# EAGLE design Oscillator 1.0 (EAGLE 7.2.0)
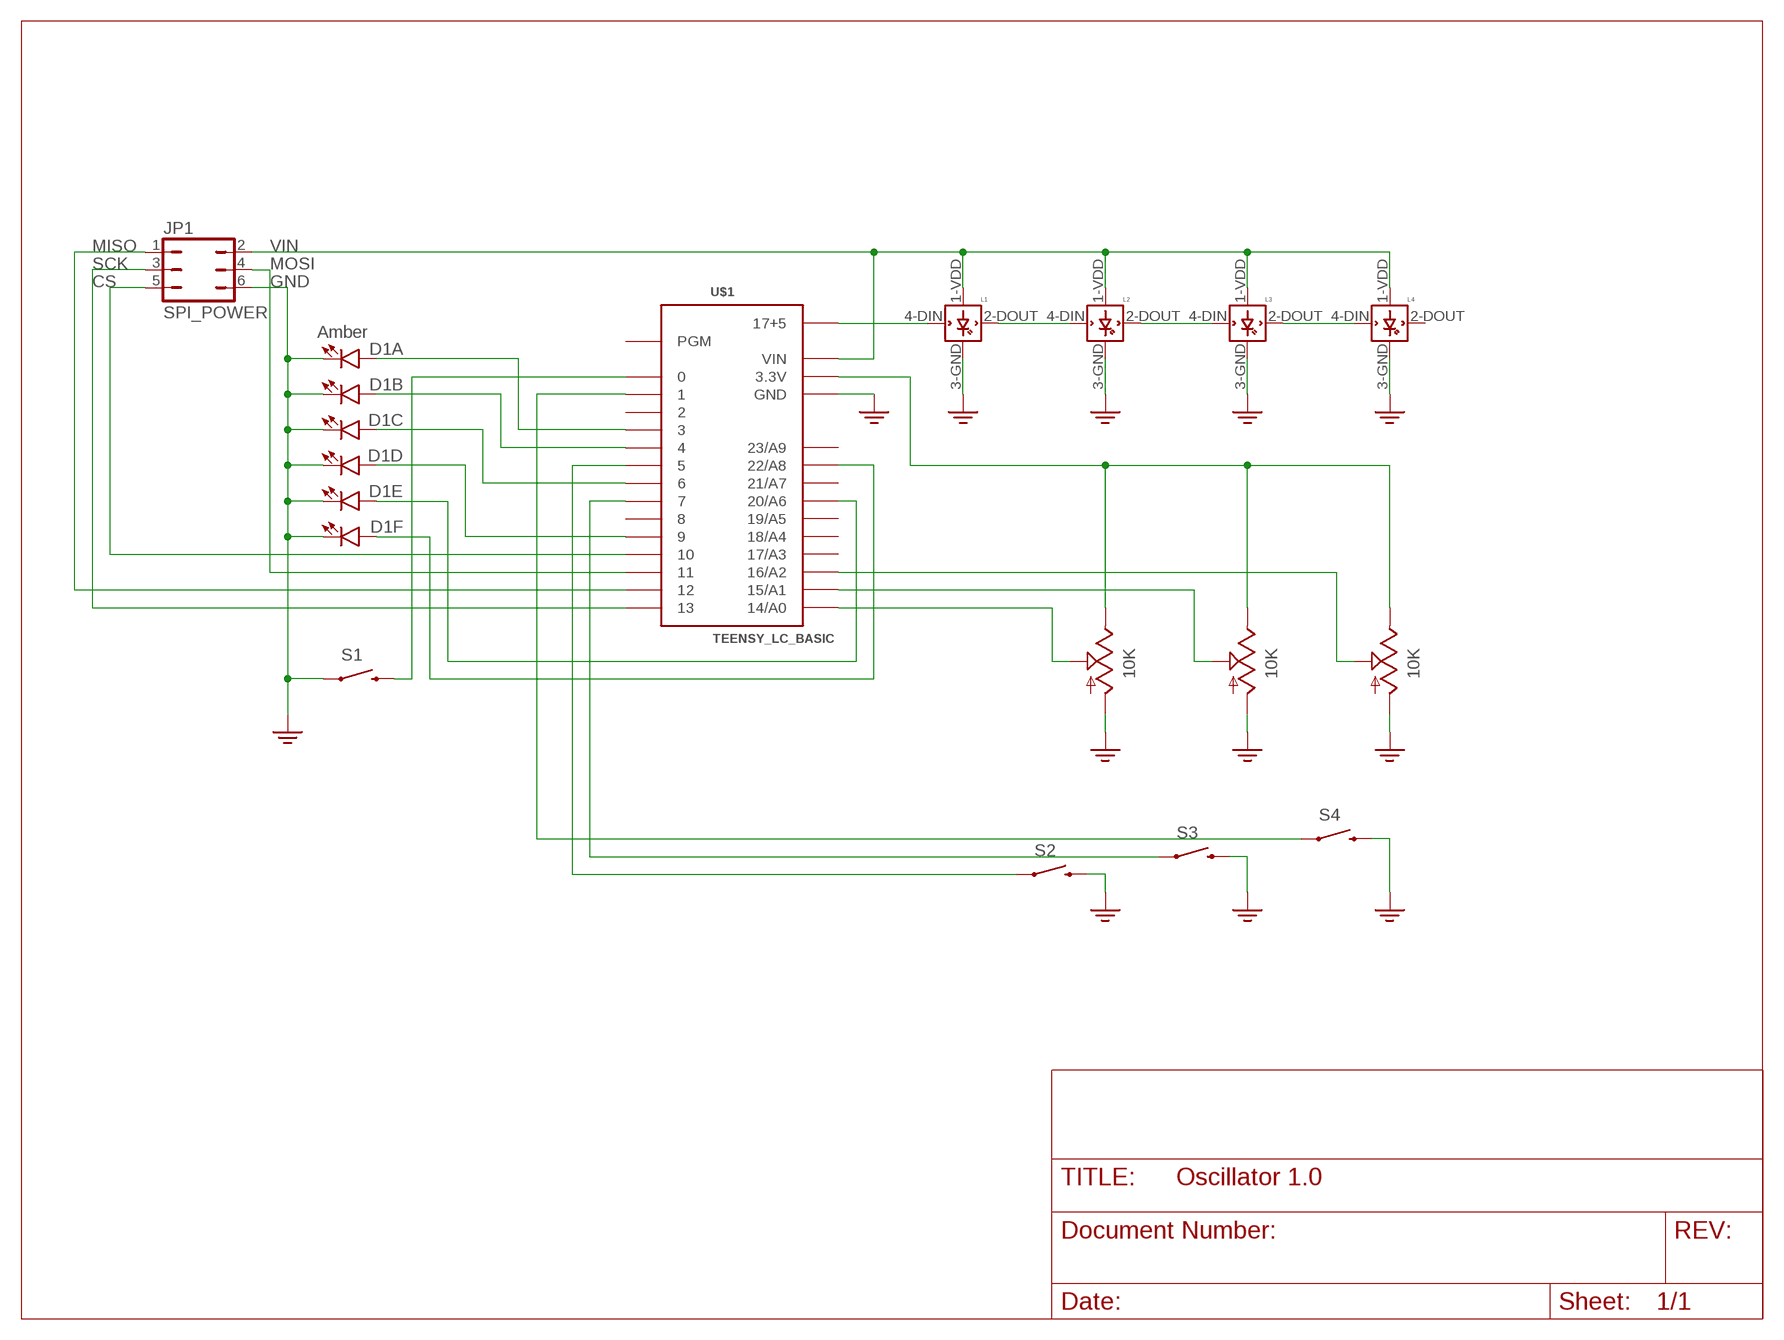
[diagram p0: schematic, sheet 1]

## Parts
D1  Amber  LED_BARGRAPH_6  [LED_BARGRAPH_6]
JP1  SPI_POWER  JP3Q  [JP3Q]
L1  WS2812B  [WS2812B]
L2  WS2812B  [WS2812B]
L3  WS2812B  [WS2812B]
L4  WS2812B  [WS2812B]
S1  SWITCH-MOMENTARY-212MM  [TACTILE-PTH-12MM]
S2  SWITCH-MOMENTARY-2SMD  [TACTILE-SWITCH-SMD]
S3  SWITCH-MOMENTARY-2SMD  [TACTILE-SWITCH-SMD]
S4  SWITCH-MOMENTARY-2SMD  [TACTILE-SWITCH-SMD]
U$1  TEENSY_LC_BASIC  [TEENSY_LC_BASIC]
U$2  10K  ALPHA1400F10K  [14MMPOT]
U$3  10K  ALPHA1400F10K  [14MMPOT]
U$4  10K  ALPHA1400F10K  [14MMPOT]

## Nets
3.3V: U$1.3.3V1(3.3V) U$2.P$4(E) U$3.P$4(E) U$4.P$4(E)
GND: D1.7(F:C) D1.8(E:C) D1.9(D:C) D1.10(C:C) D1.11(B:C) D1.12(A:C) JP1.6 L1.3-GND(GND) L2.3-GND(GND) L3.3-GND(GND) L4.3-GND(GND) S1.1 S2.3 S3.3 S4.3 U$1.GND U$1.GND1(GND) U$1.GND2(GND) U$2.P$5(A) U$3.P$5(A) U$4.P$5(A) ; supply symbol labelled GND2
N$1: L1.4-DIN(DIN) U$1.17+5
N$2: L1.2-DOUT(DOUT) L2.4-DIN(DIN)
N$3: L2.2-DOUT(DOUT) L3.4-DIN(DIN)
N$4: L3.2-DOUT(DOUT) L4.4-DIN(DIN)
N$7: U$1.14/A0 U$2.P$3(S)
N$8: U$1.15/A1 U$3.P$3(S)
N$9: U$1.16/A2 U$4.P$3(S)
N$12: S2.1 U$1.5
N$13: S3.1 U$1.7
N$14: S4.1 U$1.1
N$15: D1.1(A:A) U$1.3
N$16: D1.2(B:A) U$1.4
N$17: D1.3(C:A) U$1.6
N$18: D1.4(D:A) U$1.9
N$19: D1.5(E:A) U$1.20/A6
N$20: D1.6(F:A) U$1.22/A8
N$21: JP1.1 U$1.12
N$22: S1.3 U$1.0
N$23: JP1.3 U$1.13
N$24: JP1.5 U$1.10
N$28: JP1.4 U$1.11
VIN: JP1.2 L1.1-VDD(VDD) L2.1-VDD(VDD) L3.1-VDD(VDD) L4.1-VDD(VDD) U$1.VIN
Unconnected: L4.2-DOUT(DOUT) U$1.2 U$1.8 U$1.17/A3 U$1.18/A4 U$1.19/A5 U$1.21/A7 U$1.23/A9 U$1.PGM

## Notes on the sheet
- MISO | VIN
- SCK | MOSI
- CS | GND

## Library data of the parts
D1 = SynthLib:LED_BARGRAPH_6: 10-Segment LED Bar Graph SFE part numbers: COM-09935 (red, Vf = 2.1V, Ifmax = 20mA) COM-09936 (yellow, Vf = 2.1V, Ifmax = 20mA) COM-09937 (blue, Vf = 3.4V, Ifmax = 20mA) COM-09938 (green, Vf = 3.4V, Ifmax = 20mA)
JP1 = jumper:JP3Q: JUMPER
L1-L4 = SynthLib:WS2812B
S1 = SynthLib:SWITCH-MOMENTARY-2: Various NO switches- pushbuttons, reed, etc; PROD_ID: SWCH-09185
S2-S4 = SynthLib:SWITCH-MOMENTARY-2: Various NO switches- pushbuttons, reed, etc; PROD_ID: SWCH-08247
U$1 = SynthLib:TEENSY_LC_BASIC: Basic Teensy LC with none of the 'inner' pins enabled. See '+4', 'AllAnalogPins", and 'AllPins' packages for additional pin holes, as needed.
U$2-U$4 = SynthLib:ALPHA1400F: Alpha 1400F series clear shaft potentiometer

## Board
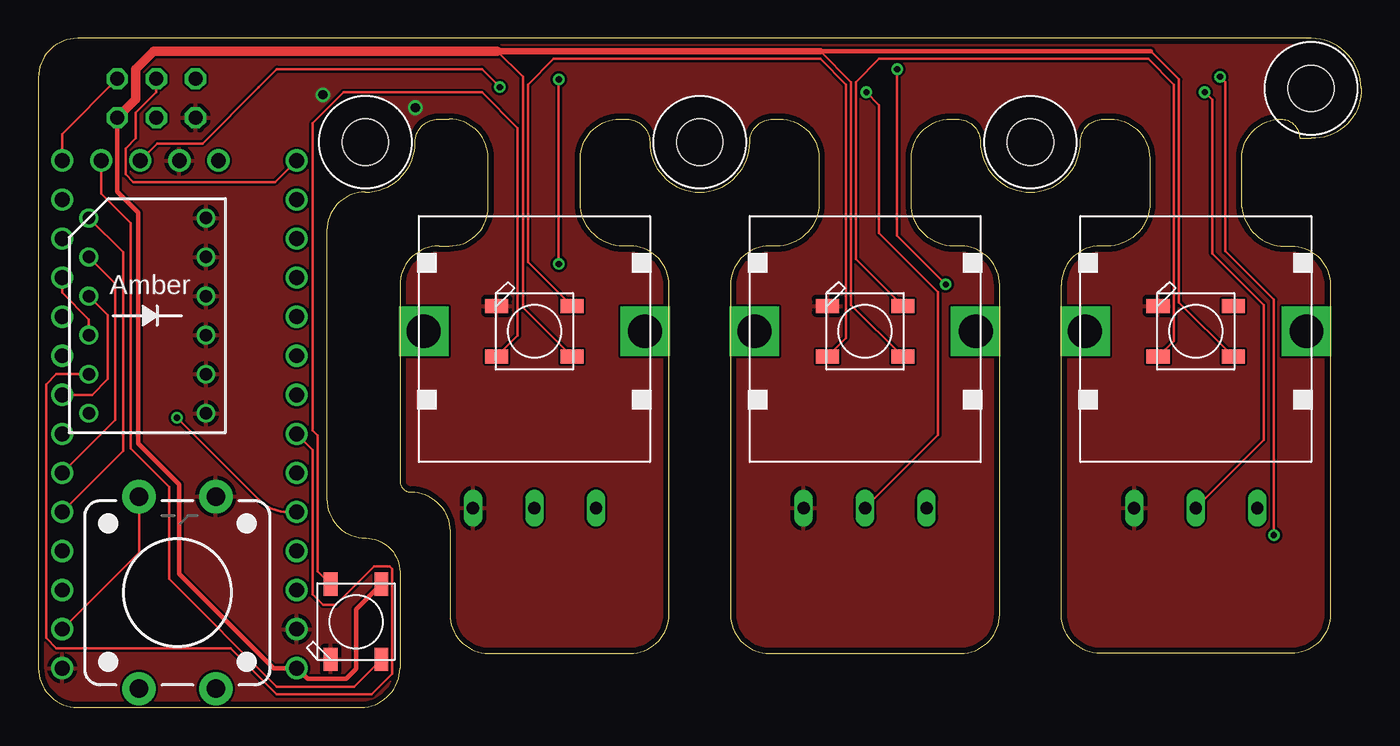
[diagram p1: board, top side]
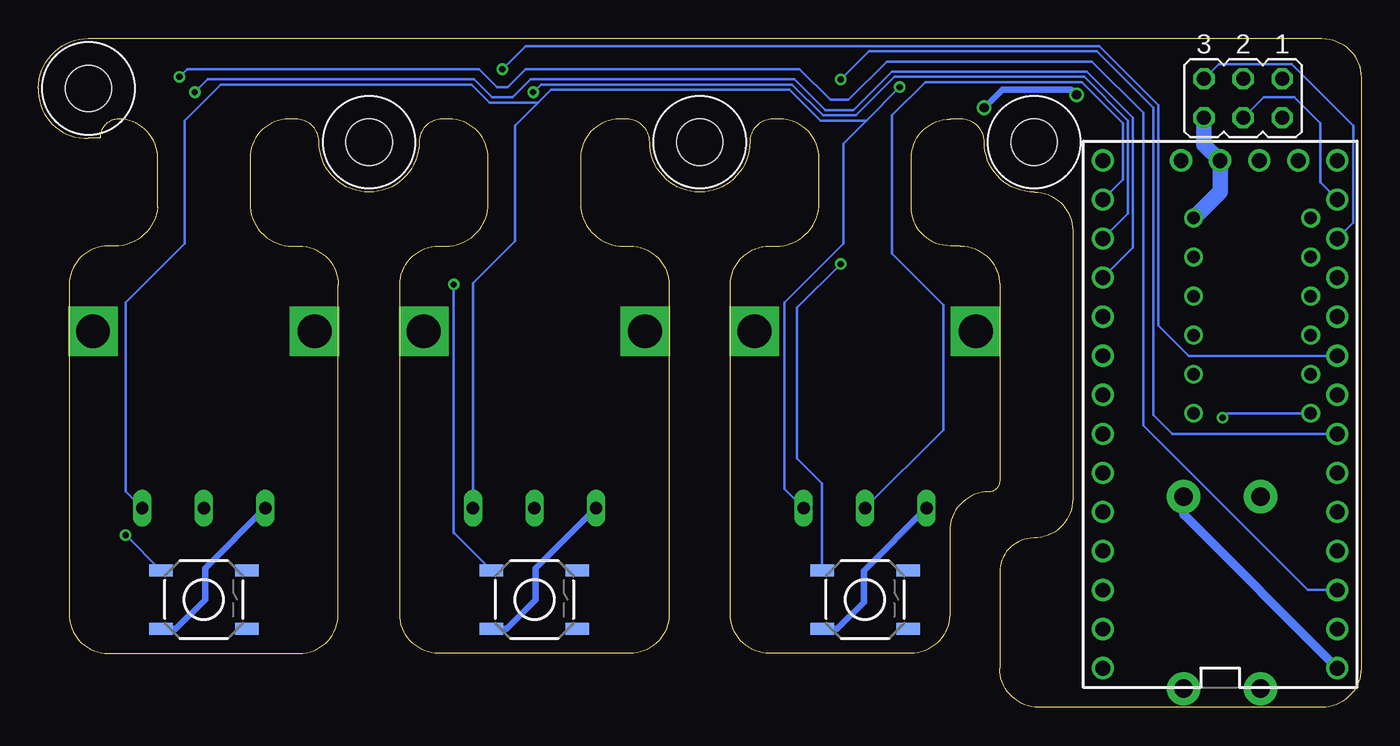
[diagram p2: board, bottom side, seen from below]

Size 86 x 43.5 mm. Coordinates in mm from the lower left corner, seen from the top.
Outline: 26.75,9.46 26.75,6.04 arc90 29.29,3.5 38.46,3.5 arc90 41,6.04 41,27.46 arc90 38.46,30 38.29,30 arc-90 35.25,32.54 35.25,35.71 arc-90 37.79,38.25 38.25,38.25 arc-90 39.75,36.75 arc90 43,33.5 arc90 46.25,36.75 arc-90 47.75,38.25 48.21,38.25 arc-90 50.75,35.71 50.75,32.54 arc-90 47.71,30 47.54,30 arc90 45,27.46 45,6.04 arc90 47.54,3.5 59.96,3.5 arc90 62.5,6.04 62.5,27.46 arc90 59.96,30 59.79,30 arc-90 56.75,32.54 56.75,35.71 arc-90 59.29,38.25 59.75,38.25 arc-90 61.25,36.75 arc90 64.5,33.5 arc90 67.75,36.75 arc-90 69.25,38.25 69.71,38.25 arc-90 72.25,35.71 72.25,32.54 arc-90 69.21,30 69.04,30 arc90 66.5,27.46 66.5,6.04 arc90 69.04,3.5 81.46,3.5 arc90 84,6.04 84,27.46 arc90 81.46,30 81.29,30 arc-90 78.25,32.54 78.25,35.71 arc-90 80.79,38.25 arc-90 82,37.04 arc90 82.04,37 82.75,37 arc90 86,40 86,40.25 arc90 82.75,43.5 2.54,43.5 arc90 0,40.96 0,2.54 arc90 2.54,0 20.96,0 arc90 23.5,2.54 23.5,8.79 arc90 21.29,11 arc-90 18.75,13.54 18.75,31 arc-90 21.25,33.5 arc90 24.5,36.75 arc-90 26,38.25 26.71,38.25 arc-90 29.25,35.71 29.25,32.54 arc-90 26.71,30 26.04,30 arc90 23.5,27.46 23.5,14.71 arc90 24.21,14 arc-90 26.75,11.46 26.75,9.5
Copper layers (1*16): Top 0.0356mm / dielectric 1.5011mm / Bottom 0.0356mm
Design rules "LaenPCBOrder *": minimum track width 6mil, minimum drill 13mil, track to track 6mil, track to pad 6mil, pad to pad 6mil, via to via 6mil, smd to smd 6mil, copper to edge 15mil, drill to drill 6mil, minimum pad ring 7mil, minimum via ring 7mil, stop-mask expansion 3mil, vias tented up to drill 0mil, thermal gap 10mil

### Footprints (pad centres in the part's own frame; a part is rotated, then mirrored left to right if it is on the bottom)
LED_BARGRAPH_6 = drill 0.813: 1 -6.35,-3.81; 2 -3.81,-3.81; 3 -1.27,-3.81; 4 1.27,-3.81; 5 3.81,-3.81; 6 6.35,-3.81; 7 6.35,3.81; 8 3.81,3.81; 9 1.27,3.81; 10 -1.27,3.81; 11 -3.81,3.81; 12 -6.35,3.81
JP3Q = drill 0.914 octagon: 1 -2.54,-1.27; 2 -2.54,1.27; 3 0,-1.27; 4 0,1.27; 5 2.54,-1.27; 6 2.54,1.27
WS2812B = smd 1.5 x 0.9: 1-VDD 2.45,-1.65; 2-DOUT 2.45,1.65; 3-GND -2.45,1.65; 4-DIN -2.45,-1.65
TACTILE-PTH-12MM = drill 1.2 pad 2.159: 1 6.25,-2.5; 2 -6.25,-2.5; 3 6.25,2.5; 4 -6.25,2.5
TACTILE-SWITCH-SMD = smd 1.524 x 0.762: 1 -2.794,1.905; 2 2.794,1.905; 3 -2.794,-1.905; 4 2.794,-1.905
TEENSY_LC_BASIC = drill 0.965: 0 -7.62,13.97; 1 -7.62,11.43; 2 -7.62,8.89; 3 -7.62,6.35; 3.3V 7.62,11.43; 3.3V1 -2.54,-16.51; 4 -7.62,3.81; 5 -7.62,1.27; 6 -7.62,-1.27; 7 -7.62,-3.81; 8 -7.62,-6.35; 9 -7.62,-8.89; 10 -7.62,-11.43; 11 -7.62,-13.97; 12 -7.62,-16.51; 13 7.62,-16.51; 14/A0 7.62,-13.97; 15/A1 7.62,-11.43; 16/A2 7.62,-8.89; 17+5 -5.08,-16.51; 17/A3 7.62,-6.35; 18/A4 7.62,-3.81; 19/A5 7.62,-1.27; 20/A6 7.62,1.27; 21/A7 7.62,3.81; 22/A8 7.62,6.35; 23/A9 7.62,8.89; GND -7.62,16.51; GND1 0,-16.51; GND2 7.62,13.97; PGM 2.54,-16.51; VIN 7.62,16.51
14MMPOT = drill 2.2 square: P$1 -7.2,0; P$2 7.2,0 | drill 0.8 long: P$3 0,-11.5; P$4 4,-11.5; P$5 -4,-11.5
STANDOFF-M3 = hole 3: 0,0

### Placement (x,y rotation side)
D1  7.08,25.47 270 top
JP1  7.67,39.6 180 bottom
L1  20.65,5.56 90 top
L2  32.25,24.45 0 top
L3  53.75,24.45 0 top
L4  75.25,24.45 0 top
S1  9.04,7.45 90 top
S2  32.25,7 0 bottom
S3  53.75,7 0 bottom
S4  75.25,7 0 bottom
U$1  9.16,19.05 180 bottom
U$2  32.25,24.45 0 top
U$3  53.75,24.45 0 top
U$4  75.25,24.45 0 top
U$6  [STANDOFF-M3]  21.25,36.75 0 top
U$7  [STANDOFF-M3]  43,36.75 0 top
U$8  [STANDOFF-M3]  64.5,36.75 0 top
U$10  [STANDOFF-M3]  82.75,40.25 0 top

### Tracks (layer width: path | path; a pad name or v marks a point on that pad's centre or on a via)
3.3V  (via drill 0.4)
  Top 0.16: 14.33,40.33 10.67,36.67 7.73,36.67 U$1.3.3V1 | 14.33,40.33 | 14.33,40.33 15.5,41.5 28.83,41.5 v30,40.33
  Bottom 0.16: U$2.P$4 37.5,14.2 37.5,26.33 33.67,30.17 33.67,36.67 32.17,38.17 | U$4.P$4 80.33,14.03 80.33,26.33 76.5,30.17 76.5,38.17 74.17,40.5 57.83,40.5 56.67,39.33 53.5,39.33 | U$3.P$4 57.75,27.58 55,30.33 55,37.83 53.5,39.33 | 53.5,39.33 52.67,40.17 37.17,40.17 35.17,38.17 32.17,38.17 | v30,40.33 | v30,40.33 32.17,38.17
GND  (via drill 0.6)
  Bottom 0.406: U$2.P$5 32.33,8.87 32.33,6.83 34.07,5.09 S2.3 | U$3.P$5 53.67,9.03 53.67,7 55.57,5.09 S3.3 | U$4.P$5 75.17,9.03 75.17,7 77.07,5.09 S4.3 | v18.5,39.83 18.83,40.17 23.33,40.17 v24.5,39
  Bottom 0.61: S1.1 11.54,12.53 U$1.GND
  Bottom 1.016: JP1.6 10.21,36.61 U$1.GND1 9.16,33.55 D1.12
  pour Top: 87,44.5 87,-1 -1,-1 -1,44.5
N$1
  Top 0.16: L1.4-DIN 20.52,1.33 15.5,1.33 8.5,8.33 8.5,14.33 6,16.83 6,31.5 4.08,33.42 U$1.17+5
N$2
  Top 0.16: L2.4-DIN 31.17,24.17 31.17,37.67 28.83,40 19.83,40 17.83,38 17.83,18 18.17,17.67 18.17,8.84 L1.2-DOUT
N$3
  Top 0.16: L2.2-DOUT 31.83,28.97 31.83,40.5 33.5,42.17 50.83,42.17 52.5,40.5 52.5,24 L3.4-DIN
N$4
  Top 0.16: L3.2-DOUT 53.17,29.13 53.17,40.67 54.67,42.17 72.17,42.17 73.83,40.5 73.83,23.83 L4.4-DIN
N$7
  Bottom 0.16: U$2.P$3 27.17,18.03 27.17,26.17 30.5,29.5 30.5,38.5 28.33,40.67 18.17,40.67 15.5,38 15.5,34.3 U$1.14/A0
N$8  (via drill 0.4)
  Top 0.16: v53.83,40 54.67,39.17 54.67,30.83 58.5,27 58.5,17.7 U$3.P$3
  Bottom 0.16: U$1.15/A1 15.17,32.1 15.17,38.17 18,41 30.33,41 32.83,38.5 35,38.5 37,40.5 53.33,40.5 v53.83,40
N$9  (via drill 0.4)
  Top 0.16: U$4.P$3 79.67,17.37 79.67,26.17 76.33,29.5 76.33,39.5 v75.83,40
  Bottom 0.16: U$1.16/A2 14.83,29.89 14.83,38.33 17.83,41.33 30.5,41.33 33,38.83 34.83,38.83 36.83,40.83 54,40.83 55.17,39.67 56.5,39.67 57.67,40.83 75,40.83 v75.83,40
N$12  (via drill 0.4)
  Top 0.16: v33.83,40.83 v33.83,28.83
  Bottom 0.16: U$1.5 12.28,17.78 13.5,19 13.5,39 17.17,42.67 32,42.67 v33.83,40.83 | v33.83,28.83 36.67,26 36.67,16.17 35.04,14.54 S2.1
N$13  (via drill 0.4)
  Top 0.16: v59,27.5 55.83,30.67 v55.83,41.5
  Bottom 0.16: U$1.7 11.19,22.86 13.17,24.83 13.17,39.17 17,43 54.33,43 v55.83,41.5 | v59,27.5 59,11.33 58.97,11.33 S3.1
N$14  (via drill 0.4)
  Top 0.16: v80.33,11.19 80.33,26.5 77.17,29.67 77.17,40.67 v76.83,41
  Bottom 0.16: U$1.1 3.45,7.62 14.17,18.33 14.17,38.67 17.5,42 30.83,42 33.33,39.5 34.5,39.5 36.5,41.5 54.33,41.5 55.5,40.33 56.17,40.33 57.33,41.5 76.33,41.5 v76.83,41 | S4.1 v80.33,11.19
N$15
  Top 0.16: D1.1 5.5,29.59 5.5,16.66 U$1.3
N$16
  Top 0.16: D1.2 5,27.55 5,18.7 U$1.4
N$17
  Top 0.16: U$1.6 3.49,20.32 4.5,21.33 4.5,25.51 D1.3
N$18
  Top 0.16: D1.4 3.27,25.23 1.54,26.96 U$1.9
N$19
  Top 0.16: D1.5 1.16,21.66 0.5,21 0.5,4.5 1.17,3.83 12.5,3.83 15.5,0.83 21.67,0.83 23,2.17 23,9 22.83,9.17 21.83,9.17 19.33,6.67 18.5,6.67 17.83,7.33 17.83,16.73 U$1.20/A6
N$20  (via drill 0.4)
  Top 0.16: v9,18.83 14.39,13.44 arc45 16.18,12.7 U$1.22/A8
  Bottom 0.16: D1.6 8.71,19.12 v9,18.83
N$21
  Top 0.16: U$1.12 1.54,37.29 JP1.1
N$22
  Top 0.16: S1.3 6.54,10.07 U$1.0
N$23
  Top 0.16: JP1.3 7.67,40 6.33,38.67 6.33,37 5.67,36.33 5.67,34.67 6.17,34.17 15.39,34.17 U$1.13
N$24
  Bottom 0.16: JP1.5 9.25,41.83 4.5,41.83 0.5,37.83 0.5,31.52 U$1.10
N$28
  Bottom 0.16: JP1.4 6.34,39.67 4.33,39.67 2.67,38 2.67,34.14 U$1.11
VIN
  Top 0.16: L2.1-VDD 31.5,26 31.5,41 29.83,42.67 | L3.1-VDD 52.83,26.17 52.83,40.67 50.83,42.67 | L4.1-VDD 74.17,26.33 74.17,40.83 72.33,42.67
  Top 0.305: 50.83,42.67 72.33,42.67 | JP1.2 5.13,33.54 6.5,32.17 6.5,17.17 9.17,14.5 9.17,8.67 15.29,2.54 U$1.VIN 17.49,1.83 20,1.83 20.67,2.5 20.67,6.38 L1.1-VDD
  Top 0.406: 29.83,42.67 50.83,42.67
  Top 0.61: JP1.2 6.33,39.54 6.33,41.5 7.5,42.67 29.83,42.67